# Altium project flight controller 2.PrjPcb
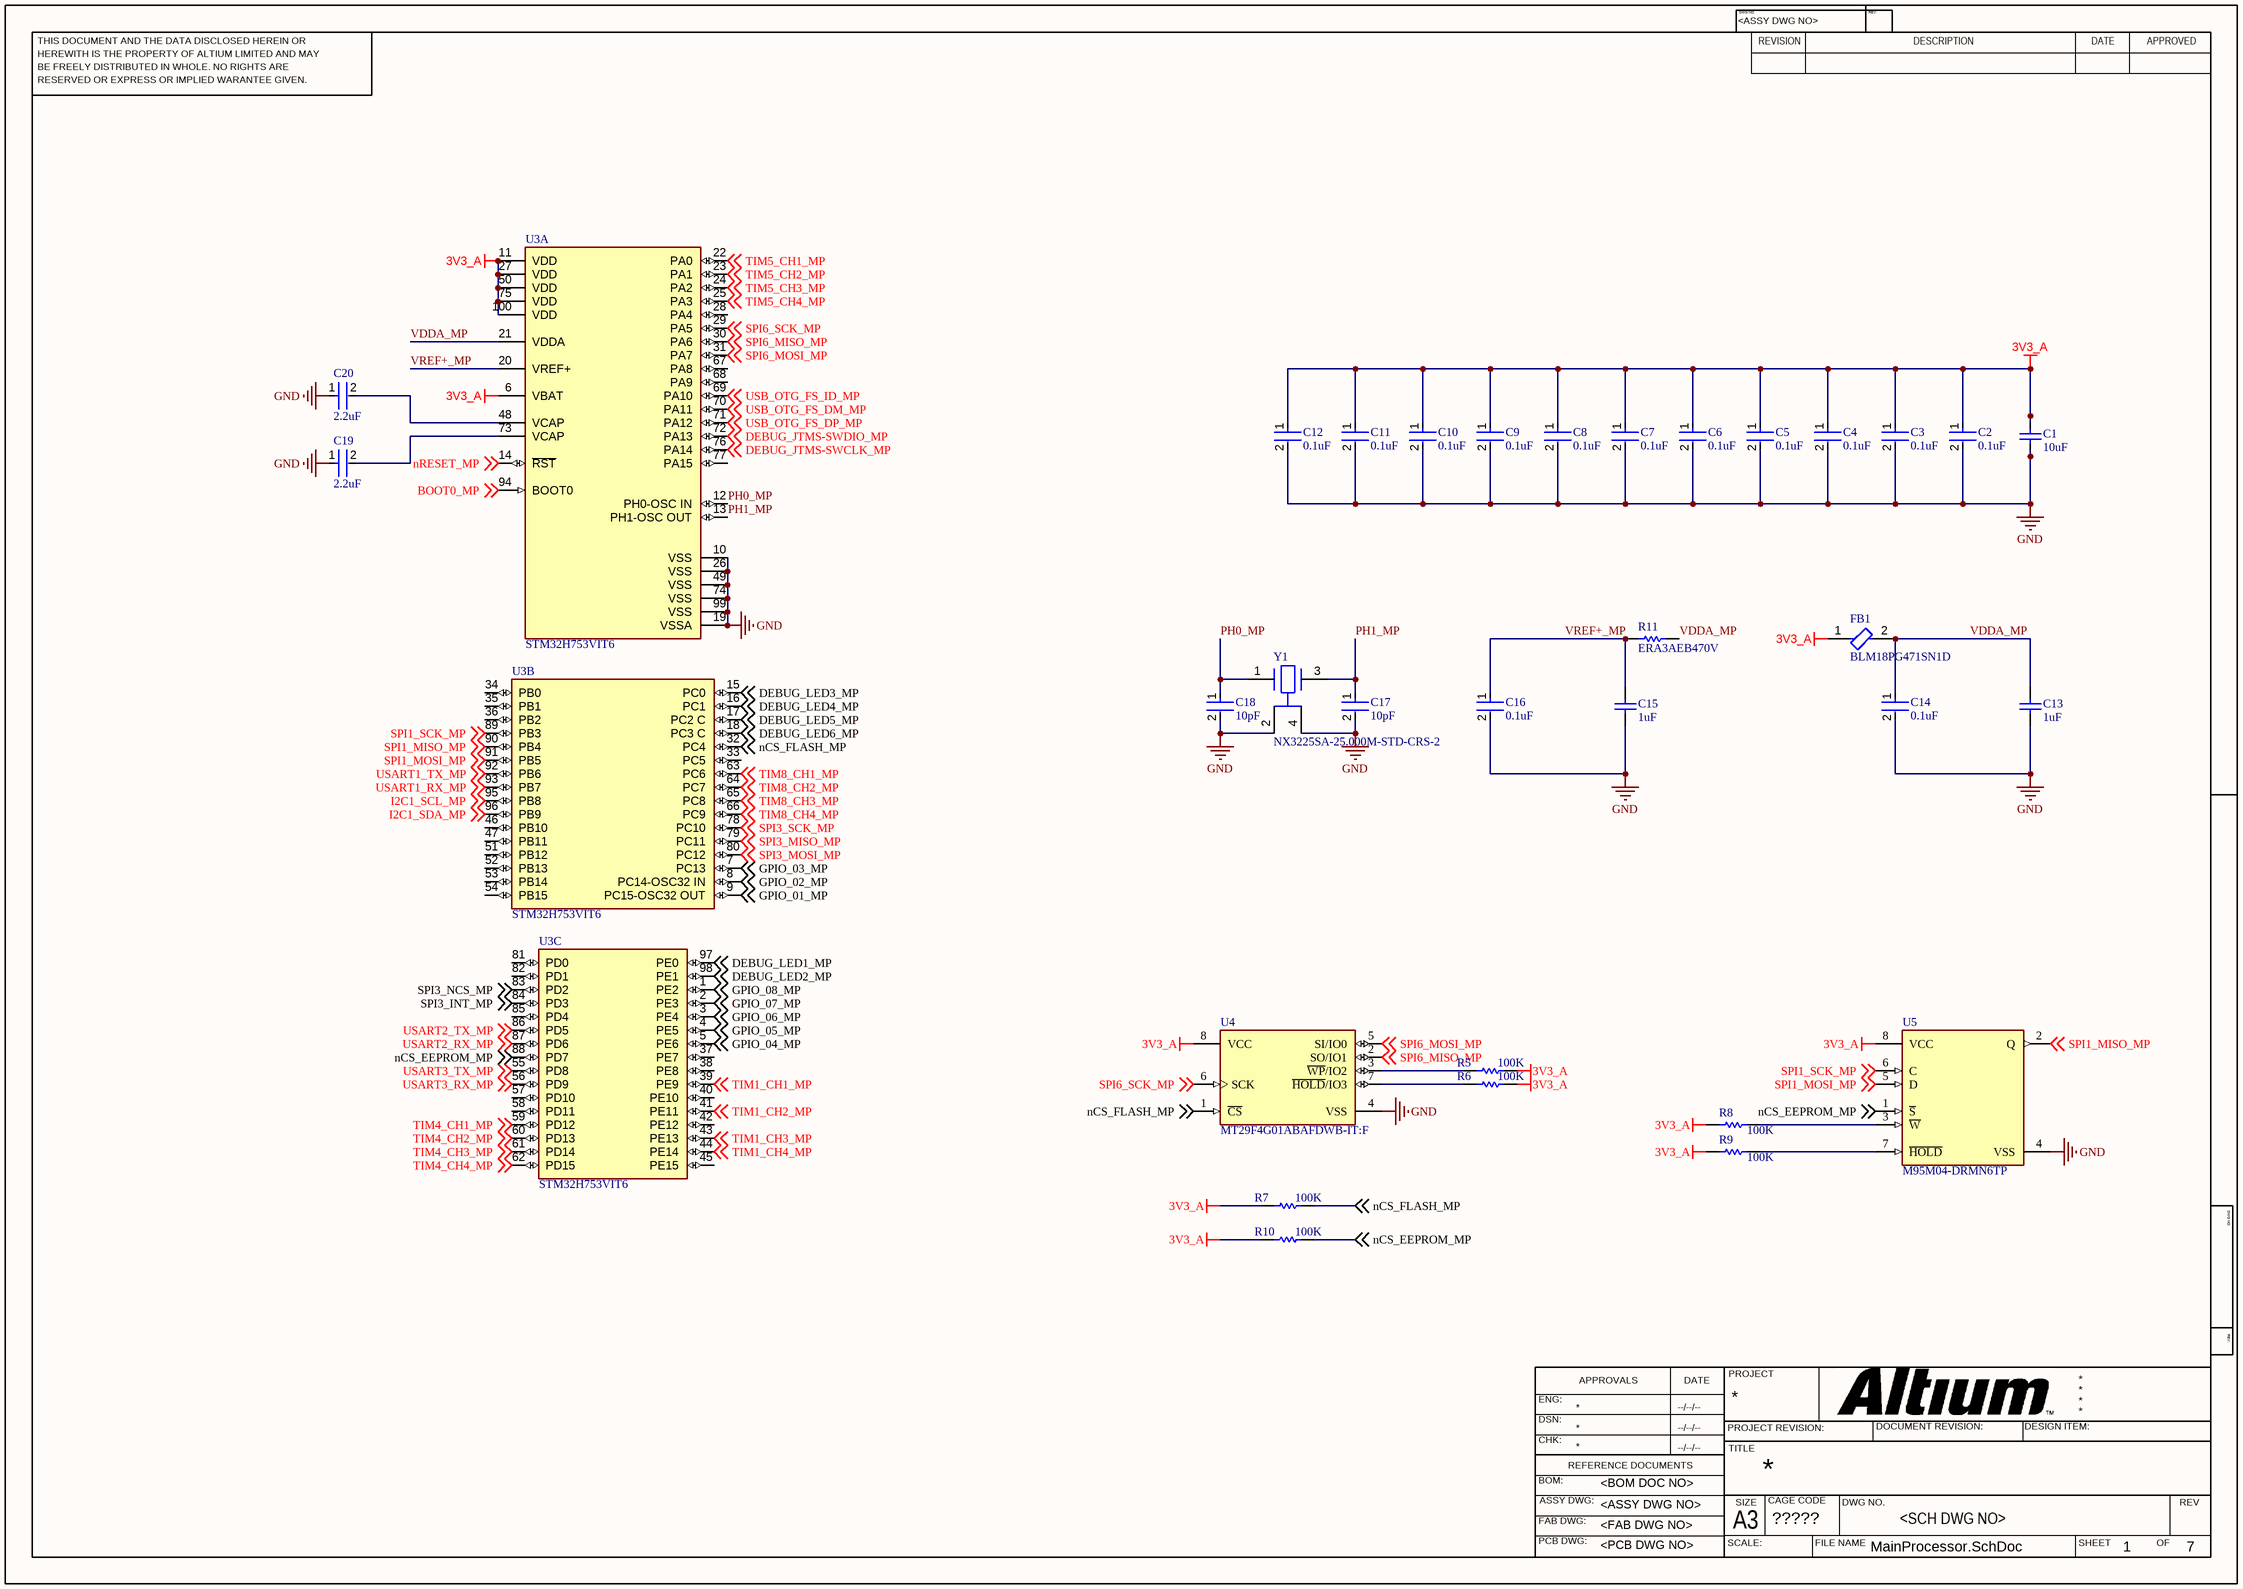
[diagram p0: MainProcessor.SchDoc]
CAGE_CODE: ?????; CONTRACT_NUMBER: <CONTRACT NO>; DOC_NO_ASSY_DWG: <ASSY DWG NO>; DOC_NO_BOM: <BOM DOC NO>; DOC_NO_FAB_DWG: <FAB DWG NO>; DOC_NO_SCH_DWG: <SCH DWG NO>; PCB_2_DEC_TOL: +/-.01; PCB_3_DEC_TOL: +/-.010; PCB_ANG_TOL: +/-1/2; PCB_ASSEMBLY_NO: <PCB ASSY NO>; PCB_CHECKER: - -----; PCB_CHECKER_APP_DATE: --/--/----; PCB_DESIGNER: - -----; PCB_DESIGNER_APP_DATE: --/--/----; PCB_DWG_NO: <PCB DWG NO>; PCB_ENGINEER: - -----; PCB_ENGINEER_APP_DATE: --/--/----; PCB_PART_NUMBER: <PCB PN>; PCB_REV: A; SCH_REV: A
4 sheets, 123 parts. Net scope: global (net labels, ports and power ports of the same name join across sheets).
Board file: flight controller rev2.PcbDoc
Sheets:
  MainProcessor.SchDoc
  CoProcessor.SchDoc
  Debug.SchDoc
  Baro_Mag.SchDoc

## Sheet MainProcessor.SchDoc
size 420 x 297 mm; SheetNumber: 1; SheetTotal: 7; ENG_APP_DATE: --/--/--; DSN_APP_DATE: --/--/--; CHK_APP_DATE: --/--/--

### Parts
C1  10uF  [CAPC2013X145X50LL20T25]
C2  0.1uF  [FP-C0603C-CF-MFG]
C3  0.1uF  [FP-C0603C-CF-MFG]
C4  0.1uF  [FP-C0603C-CF-MFG]
C5  0.1uF  [FP-C0603C-CF-MFG]
C6  0.1uF  [FP-C0603C-CF-MFG]
C7  0.1uF  [FP-C0603C-CF-MFG]
C8  0.1uF  [FP-C0603C-CF-MFG]
C9  0.1uF  [FP-C0603C-CF-MFG]
C10  0.1uF  [FP-C0603C-CF-MFG]
C11  0.1uF  [FP-C0603C-CF-MFG]
C12  0.1uF  [FP-C0603C-CF-MFG]
C13  1uF  [CAPC1608X90X35LL15T15]
C14  0.1uF  [FP-C0603C-CF-MFG]
C15  1uF  [CAPC1608X90X35LL15T15]
C16  0.1uF  [FP-C0603C-CF-MFG]
C17  10pF  [FP-C0603C-CF-MFG]
C18  10pF  [FP-C0603C-CF-MFG]
C19  2.2uF  [FP-GRM188-0_1-e0_2_0_5-MFG]
C20  2.2uF  [FP-GRM188-0_1-e0_2_0_5-MFG]
FB1  BLM18PG471SN1D  [FP-BLM18-0_15-t0_8-MFG]
R5  100K  [RESC1608X55X30ML20T10]
R6  100K  [RESC1608X55X30ML20T10]
R7  100K  [RESC1608X55X30ML20T10]
R8  100K  [RESC1608X55X30ML20T10]
R9  100K  [RESC1608X55X30ML20T10]
R10  100K  [RESC1608X55X30ML20T10]
R11  ERA3AEB470V  [RESC1608X55X30NL20T20]
U3  STM32H753VIT6  [FP-LQFP100-1L-MFG]  (parts A,B,C of 3)
U4  MT29F4G01ABAFDWB-IT:F  [FP-WB-IPC_B]
U5  M95M04-DRMN6TP  [FP-SO8N-SO-A-IPC_C]
Y1  NX3225SA-25.000M-STD-CRS-2  [FP-NX3225SA-MFG]

### Nets
3V3_A: C1.1 C2.1 C3.1 C4.1 C5.1 C6.1 C7.1 C8.1 C9.1 C10.1 C11.1 C12.1 FB1.1 R5.2 R6.2 R7.2 R8.2 R9.2 R10.2 U3.6(VBAT) U3.11(VDD) U3.27(VDD) U3.50(VDD) U3.75(VDD) U3.100(VDD) U4.8(VCC) U5.8(VCC)
GND: C1.2 C2.2 C3.2 C4.2 C5.2 C6.2 C7.2 C8.2 C9.2 C10.2 C11.2 C12.2 C13.2 C14.2 C15.2 C16.2 C17.2 C18.2 C19.1 C20.1 U3.10(VSS) U3.19(VSSA) U3.26(VSS) U3.49(VSS) U3.74(VSS) U3.99(VSS) U4.4(VSS) U5.4(VSS) Y1.2(GND) Y1.4(GND)
BOOT0_MP: U3.94(BOOT0) ; off-sheet BOOT0_MP
DEBUG_JTMS-SWCLK_MP: U3.76(PA14) ; off-sheet DEBUG_JTMS-SWCLK_MP
DEBUG_JTMS-SWDIO_MP: U3.72(PA13) ; off-sheet DEBUG_JTMS-SWDIO_MP
DEBUG_LED1_MP: U3.97(PE0) ; off-sheet DEBUG_LED1_MP
DEBUG_LED2_MP: U3.98(PE1) ; off-sheet DEBUG_LED2_MP
DEBUG_LED3_MP: U3.15(PC0) ; off-sheet DEBUG_LED3_MP
DEBUG_LED4_MP: U3.16(PC1) ; off-sheet DEBUG_LED4_MP
DEBUG_LED5_MP: U3.17(PC2_C) ; off-sheet DEBUG_LED5_MP
DEBUG_LED6_MP: U3.18(PC3_C) ; off-sheet DEBUG_LED6_MP
GPIO_01_MP: U3.9(PC15-OSC32_OUT) ; off-sheet GPIO_01_MP
GPIO_02_MP: U3.8(PC14-OSC32_IN) ; off-sheet GPIO_02_MP
GPIO_03_MP: U3.7(PC13) ; off-sheet GPIO_03_MP
GPIO_04_MP: U3.5(PE6) ; off-sheet GPIO_04_MP
GPIO_05_MP: U3.4(PE5) ; off-sheet GPIO_05_MP
GPIO_06_MP: U3.3(PE4) ; off-sheet GPIO_06_MP
GPIO_07_MP: U3.2(PE3) ; off-sheet GPIO_07_MP
GPIO_08_MP: U3.1(PE2) ; off-sheet GPIO_08_MP
I2C1_SCL_MP: U3.95(PB8) ; off-sheet I2C1_SCL_MP
I2C1_SDA_MP: U3.96(PB9) ; off-sheet I2C1_SDA_MP
nCS_EEPROM_MP: R10.1 U3.88(PD7) U5.1(~{S}) ; off-sheet nCS_EEPROM_MP
nCS_FLASH_MP: R7.1 U3.32(PC4) U4.1(~{CS}) ; off-sheet nCS_FLASH_MP
nRESET_MP: U3.14(~{RST}) ; off-sheet nRESET_MP
PH0_MP: C18.1 U3.12(PH0-OSC_IN) Y1.1
PH1_MP: C17.1 U3.13(PH1-OSC_OUT) Y1.3
SPI1_MISO_MP: U3.90(PB4) U5.2(Q) ; off-sheet SPI1_MISO_MP
SPI1_MOSI_MP: U3.91(PB5) U5.5(D) ; off-sheet SPI1_MOSI_MP
SPI1_SCK_MP: U3.89(PB3) U5.6(C) ; off-sheet SPI1_SCK_MP
SPI3_INT_MP: U3.84(PD3) ; off-sheet SPI3_INT_MP
SPI3_MISO_MP: U3.79(PC11) ; off-sheet SPI3_MISO_MP
SPI3_MOSI_MP: U3.80(PC12) ; off-sheet SPI3_MOSI_MP
SPI3_NCS_MP: U3.83(PD2) ; off-sheet SPI3_NCS_MP
SPI3_SCK_MP: U3.78(PC10) ; off-sheet SPI3_SCK_MP
SPI6_MISO_MP: U3.30(PA6) U4.2(SO/IO1) ; off-sheet SPI6_MISO_MP
SPI6_MOSI_MP: U3.31(PA7) U4.5(SI/IO0) ; off-sheet SPI6_MOSI_MP
SPI6_SCK_MP: U3.29(PA5) U4.6(SCK) ; off-sheet SPI6_SCK_MP
TIM1_CH1_MP: U3.39(PE9) ; off-sheet TIM1_CH1_MP
TIM1_CH2_MP: U3.41(PE11) ; off-sheet TIM1_CH2_MP
TIM1_CH3_MP: U3.43(PE13) ; off-sheet TIM1_CH3_MP
TIM1_CH4_MP: U3.44(PE14) ; off-sheet TIM1_CH4_MP
TIM4_CH1_MP: U3.59(PD12) ; off-sheet TIM4_CH1_MP
TIM4_CH2_MP: U3.60(PD13) ; off-sheet TIM4_CH2_MP
TIM4_CH3_MP: U3.61(PD14) ; off-sheet TIM4_CH3_MP
TIM4_CH4_MP: U3.62(PD15) ; off-sheet TIM4_CH4_MP
TIM5_CH1_MP: U3.22(PA0) ; off-sheet TIM5_CH1_MP
TIM5_CH2_MP: U3.23(PA1) ; off-sheet TIM5_CH2_MP
TIM5_CH3_MP: U3.24(PA2) ; off-sheet TIM5_CH3_MP
TIM5_CH4_MP: U3.25(PA3) ; off-sheet TIM5_CH4_MP
TIM8_CH1_MP: U3.63(PC6) ; off-sheet TIM8_CH1_MP
TIM8_CH2_MP: U3.64(PC7) ; off-sheet TIM8_CH2_MP
TIM8_CH3_MP: U3.65(PC8) ; off-sheet TIM8_CH3_MP
TIM8_CH4_MP: U3.66(PC9) ; off-sheet TIM8_CH4_MP
USART1_RX_MP: U3.93(PB7) ; off-sheet USART1_RX_MP
USART1_TX_MP: U3.92(PB6) ; off-sheet USART1_TX_MP
USART2_RX_MP: U3.87(PD6) ; off-sheet USART2_RX_MP
USART2_TX_MP: U3.86(PD5) ; off-sheet USART2_TX_MP
USART3_RX_MP: U3.56(PD9) ; off-sheet USART3_RX_MP
USART3_TX_MP: U3.55(PD8) ; off-sheet USART3_TX_MP
USB_OTG_FS_DM_MP: U3.70(PA11) ; off-sheet USB_OTG_FS_DM_MP
USB_OTG_FS_DP_MP: U3.71(PA12) ; off-sheet USB_OTG_FS_DP_MP
USB_OTG_FS_ID_MP: U3.69(PA10) ; off-sheet USB_OTG_FS_ID_MP
VDDA_MP: C13.1 C14.1 FB1.2 R11.2 U3.21(VDDA)
VREF+_MP: C15.1 C16.1 R11.1 U3.20(VREF+)
NetC19_2: C19.2 U3.73(VCAP)
NetC20_2: C20.2 U3.48(VCAP)
NetR5_1: R5.1 U4.3(~{WP}/IO2)
NetR6_1: R6.1 U4.7(~{HOLD}/IO3)
NetR8_1: R8.1 U5.3(~{W})
NetR9_1: R9.1 U5.7(~{HOLD})

Not connected (* = marked no-connect by the designer): U3 28(PA4) 33(PC5) 34(PB0) 35(PB1) 36(PB2) 37(PE7) 38(PE8) 40(PE10) 42(PE12) 45(PE15) 46(PB10) 47(PB11) 51(PB12) 52(PB13) 53(PB14) 54(PB15) 57(PD10) 58(PD11) 67(PA8) 68(PA9) 77(PA15) 81(PD0) 82(PD1) 85(PD4)

### Notes on the sheet
- THIS DOCUMENT AND THE DATA DISCLOSED HEREIN OR
- HEREWITH IS THE PROPERTY OF ALTIUM LIMITED AND MAY
- DWG NO:
- REVISION
- REV:
- DESCRIPTION
- DATE
- APPROVED
- BE FREELY DISTRIBUTED IN WHOLE. NO RIGHTS ARE
- RESERVED OR EXPRESS OR IMPLIED WARANTEE GIVEN.
- ENG:
- APPROVALS
- PROJECT
- DSN:
- CHK:
- REFERENCE DOCUMENTS
- PROJECT REVISION:
- TITLE
- DOCUMENT REVISION:
- DESIGN ITEM:
- BOM:
- FAB DWG:
- PCB DWG:
- ASSY DWG:
- SCALE:
- A3
- SIZE
- CAGE CODE
- FILE NAME
- DWG NO.
- SHEET
- OF
- REV

### Library data of the parts
C1 = CMP-2007-01044-1: Manufacturer: Kemet; Part Number: C0805C106K8RACTU
C2-C12 C14 C16 = CMP-2006-03061-2: CAP CER 0.1UF 50V X7R 0603; Manufacturer: KEMET; Manufacturer Part Number: C0603C104K5RACTU; Tolerance: 0.1; Temperature Coefficient: 30ppm/°C; Material: Ceramic; Automotive Grade: Grade 1; Value: 0.10 μF; Temperature: -55°C to +125°C; RoHS: TRUE; Temperature Range High: +125°C; Lead Free: Yes; Octopart: https://octopart.com/c0603c104k5ractu-kemet-139244; Digikey Description: CAP CER 0.1UF 50V X7R 0603; Category: Cap; Package: C0603C-CF; ComponentLink2Description: Datasheet; Temperature Range Low: -55°C; Device Class L1: Passive Components; Voltage Rating: 50 V; Automotive: Yes; Device Class L3: Ceramic Capacitors; ComponentLink2URL: https://api.kemet.com/component-edge/download/datasheet/C0603C100J5GACAUTO.pdf; Capacitance: 0.10 μF; Device Class L2: Capacitors; Temperature Characteristic: X7R; Height: 0.87mm
C13 C15 = CMP-2006-02298-2: Manufacturer: Kemet; Part Number: C0603C105K4RACTU
C17 C18 = CMP-2006-03343-2: CAP CER 10PF 50V NP0 0603; Manufacturer: KEMET; Manufacturer Part Number: C0603C100C5GACTU; Material: Ceramic; Temperature Coefficient: 30ppm/°C; Automotive Grade: Grade 1; Tolerance: 0.25 pF; Temperature Characteristic: C0G; Device Class L3: Ceramic Capacitors; Value: 10 pF; Device Class L1: Passive Components; Lead Free: Yes; RoHS: TRUE; Voltage Rating: 50 V; Automotive: Yes; Capacitance: 10 pF; Height: 0.87mm; Temperature Range Low: -55°C; Temperature Range High: +125°C; Mouser Description: Multilayer Ceramic Capacitors MLCC - SMD/SMT 50volts 10pF C0G 0.25%; Device Class L2: Capacitors; Digikey Description: CAP CER 10PF 50V NP0 0603; ComponentLink2Description: Datasheet; Package: C0603C-CF; ComponentLink2URL: https://api.kemet.com/component-edge/download/datasheet/C0603C100J5GACAUTO.pdf; Category: Cap; Octopart: https://octopart.com/c0603c100c5gactu-kemet-9138556; Temperature: -55°C to +125°C
C19 C20 = CMP-2006-02836-2: Chip Multilayer Ceramic Capacitors for General Purpose, 0603, 2.2uF, X7R, 15%, 10%, 10V; Case Code (Metric): 1608; Height: 0.8mm; Packaging: Cut Tape; Voltage: 10V; Lead Free: Lead Free; Min Operating Temperature: -55°C; Voltage Rating (DC): 10V; Max Operating Temperature: 125°C; Voltage Rating: 10V; Dielectric: X7R; Depth: 0.8mm; Case Code (Imperial): 0603; Termination: SMD/SMT; Case/Package: 0603; Number of Pins: 2; REACH SVHC: No SVHC; Mount: Surface Mount; Width: 0.031inch; Material: Ceramic; Capacitance: 2.2uF; Package Quantity: 1; Weight: 7.1E-05oz; Length: 1.6mm; Thickness: 0.035inch; Tolerance: 10%
FB1 = CMP-0686-00587-3: Chip Ferrite Bead, 0603, 470Ω @ 100MHz, 0.2Ω, 25%, 1A; DC Resistance (DCR): 200mR; Number of Circuits: 1; Material: Steel; Impedance: 470R; Core Material: Ferrite; Width: 0.8mm; Termination: SMD/SMT; Series: BLM18P; Min Operating Temperature: -55°C; DC Resistance-Max: 200mR; Current Rating: 1A; Package Quantity: 1; Max Operating Temperature: 125°C; Military Standard: Not; REACH SVHC: No SVHC; Max Current Rating: 1A; Number of Pins: 2; RoHS Compliant: Yes; Tolerance: 25%; Packaging: Tape and Reel; Number of Lines: 1; Resistance: 200mR; Length: 1.6mm; Case Code (Metric): 1608; Depth: 0.8mm; Lead Free: Lead Free; Case/Package: 0603; Height: 0.8mm; Radiation Hardening: No; Test Frequency: 100MHz; Case Code (Imperial): 0603; Max DC Current: 1A; DC Current: 1A
R5-R10 = CMP-2000-01852-1: Part Number: RK73B1JTTD104J; Manufacturer: KOA Speer
R11 = CMP-2000-00070-1: Manufacturer: Panasonic; Part Number: ERA3AEB470V
U3 = CMP-12105-000037-1: LQFP 100 14X14X1.4; Manufacturer: STMicroelectronics; Number Of Cores: 1; Interface: I2C,SPI,UART,USART,CAN,USB,Ethernet,I2S,Other; Standoff Height: 0.05mm; Number Of Pwm Channels: 2; Number Of Timers/Counters: 20; Number Of A/D Converters: 5; Number Of Uart Channels: 4; Memory Type: FLASH; Number Of Spi Channels: 6; Core Architecture: ARM Cortex-M7; Max Junction Temp: +125°C; Max Supply Voltage: 3.6V; Number Of Adc Channels: 36; Data Bus Width: 32bits; Number Of I/Os: 82; Ram Size: 1MBytes; Frequency: 480MHz; Memory Size: 2MBytes; Min Supply Voltage: 1.71V; Lead Free: Yes; Octopart: https://octopart.com/stm32h753vit6-stmicroelectronics-87879769; Category: IC; Digikey Description: LQFP 100 14X14X1.4; ComponentLink2Description: Datasheet; RoHS: TRUE; Device Class L1: Integrated Circuits (ICs); Mouser Description: MCU 32-Bit STM32 ARM Cortex M7 RISC 2MB Flash 1.8V/2.5V/3.3V 100-Pin LQFP Tray; ComponentLink2URL: https://www.st.com/resource/en/datasheet/stm32h753vi.pdf; Ambient Temperature Range Low: -40°C; Device Class L3: Microcontrollers; Ambient Temperature Range High: +85°C; Temperature Range Low: -40°C; Height: 1.6mm; Temperature Range High: +85°C; Automotive: No; Number Of I2C Channels: 4; Temperature: -40°C to +85°C; Ipc Land Pattern Name: QFP50P1600X1600X160-100; Manufacturer Part Number: STM32H753VIT6; Device Class L2: Embedded Processors and Controllers; Package: LQFP100-1L
U4 = CMP-14958-000017-1: IC FLASH 4GBIT SPI UPDFN; Memory Type: Non-Volatile; Memory Size: 4Gb; Min Operating Temperature: -40°C; Packaging: Box; Series: -; Max Operating Temperature: 85°C
U5 = CMP-12142-000020-1: STANDARD SERIAL EEPROM; RoHS Compliant: Yes
Y1 = CMP-200220-000002-1: CRYSTAL 25.0000MHZ 8PF SMD; Manufacturer: NDK; Frequency: 25MHz; Automotive Grade: Grade 1; Esr: 100Ω; Tolerance: 15ppm; Digikey Description: CRYSTAL 25.0000MHZ 8PF SMD; Temperature Range Low: -40°C; Octopart: https://octopart.com/nx3225sa-25.000m-std-crs-2-ndk-51374293; Series: NX3225SA; Manufacturer Part Number: NX3225SA-25.000M-STD-CRS-2; ComponentLink2URL: https://www.ndk.com/images/products/catalog/c_NX3225SA-STD-CRS-2_e.pdf; Lead Free: Yes; Device Class L2: Crystals / Oscillators; ComponentLink2Description: Datasheet; Device Class L3: Crystals; Category: Crys; Device Class L1: Passive Components; Automotive: Yes; RoHS: TRUE; Load Capacitance: 8pF; Height: 0.6mm; Temperature Range High: +125°C; Package: NX3225SA; Temperature: -40°C to +125°C

## Sheet CoProcessor.SchDoc
size 420 x 297 mm; SheetNumber: 2; SheetTotal: 7
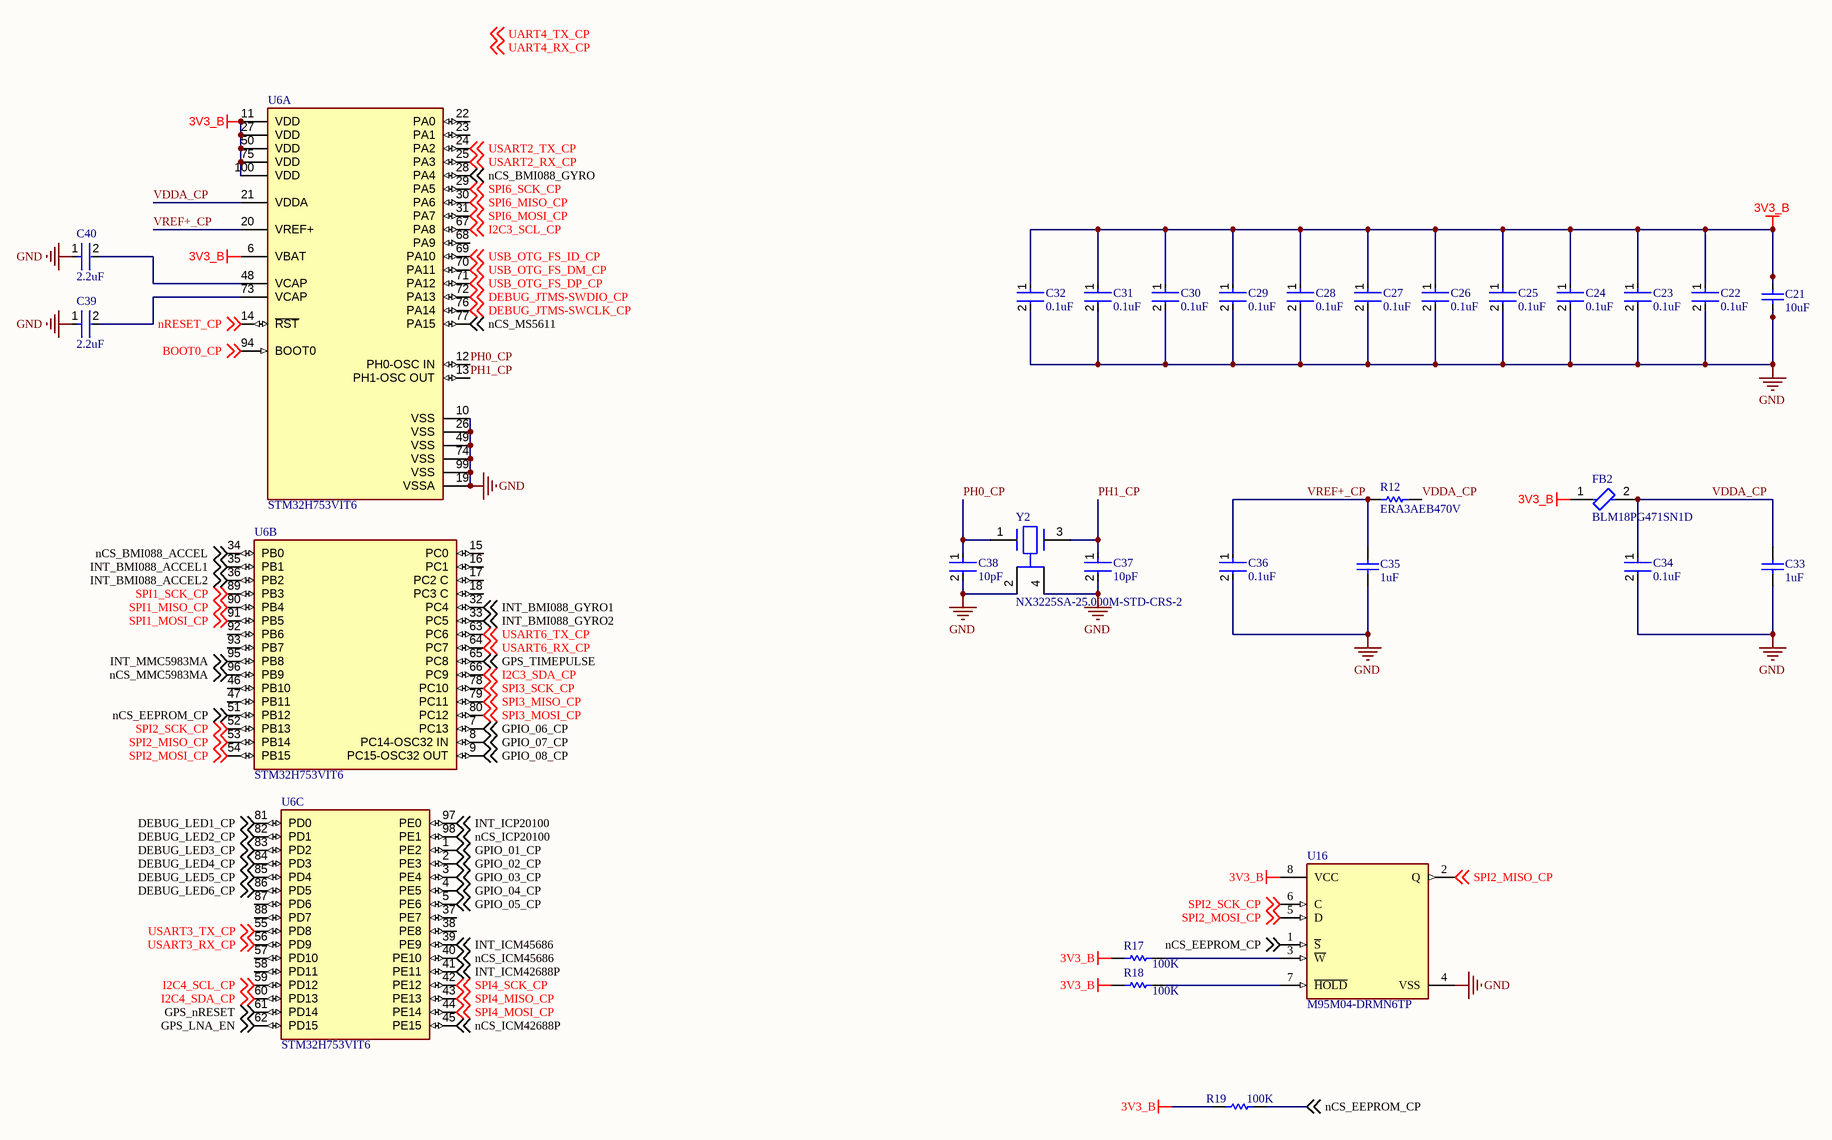
[diagram p1: CoProcessor.SchDoc]

### Parts
C21  10uF  [CAPC2013X145X50LL20T25]
C22  0.1uF  [FP-C0603C-CF-MFG]
C23  0.1uF  [FP-C0603C-CF-MFG]
C24  0.1uF  [FP-C0603C-CF-MFG]
C25  0.1uF  [FP-C0603C-CF-MFG]
C26  0.1uF  [FP-C0603C-CF-MFG]
C27  0.1uF  [FP-C0603C-CF-MFG]
C28  0.1uF  [FP-C0603C-CF-MFG]
C29  0.1uF  [FP-C0603C-CF-MFG]
C30  0.1uF  [FP-C0603C-CF-MFG]
C31  0.1uF  [FP-C0603C-CF-MFG]
C32  0.1uF  [FP-C0603C-CF-MFG]
C33  1uF  [CAPC1608X90X35LL15T15]
C34  0.1uF  [FP-C0603C-CF-MFG]
C35  1uF  [CAPC1608X90X35LL15T15]
C36  0.1uF  [FP-C0603C-CF-MFG]
C37  10pF  [FP-C0603C-CF-MFG]
C38  10pF  [FP-C0603C-CF-MFG]
C39  2.2uF  [FP-GRM188-0_1-e0_2_0_5-MFG]
C40  2.2uF  [FP-GRM188-0_1-e0_2_0_5-MFG]
FB2  BLM18PG471SN1D  [FP-BLM18-0_15-t0_8-MFG]
R12  ERA3AEB470V  [RESC1608X55X30NL20T20]
R17  100K  [RESC1608X55X30ML20T10]
R18  100K  [RESC1608X55X30ML20T10]
R19  100K  [RESC1608X55X30ML20T10]
U6  STM32H753VIT6  [FP-LQFP100-1L-MFG]  (parts A,B,C of 3)
U16  M95M04-DRMN6TP  [FP-SO8N-SO-A-IPC_C]
Y2  NX3225SA-25.000M-STD-CRS-2  [FP-NX3225SA-MFG]

### Nets
3V3_B: C21.1 C22.1 C23.1 C24.1 C25.1 C26.1 C27.1 C28.1 C29.1 C30.1 C31.1 C32.1 FB2.1 R17.2 R18.2 R19.2 U6.6(VBAT) U6.11(VDD) U6.27(VDD) U6.50(VDD) U6.75(VDD) U6.100(VDD) U16.8(VCC)
GND: C21.2 C22.2 C23.2 C24.2 C25.2 C26.2 C27.2 C28.2 C29.2 C30.2 C31.2 C32.2 C33.2 C34.2 C35.2 C36.2 C37.2 C38.2 C39.1 C40.1 U6.10(VSS) U6.19(VSSA) U6.26(VSS) U6.49(VSS) U6.74(VSS) U6.99(VSS) U16.4(VSS) Y2.2(GND) Y2.4(GND)
BOOT0_CP: U6.94(BOOT0) ; off-sheet BOOT0_CP
DEBUG_JTMS-SWCLK_CP: U6.76(PA14) ; off-sheet DEBUG_JTMS-SWCLK_CP
DEBUG_JTMS-SWDIO_CP: U6.72(PA13) ; off-sheet DEBUG_JTMS-SWDIO_CP
DEBUG_LED1_CP: U6.81(PD0) ; off-sheet DEBUG_LED1_CP
DEBUG_LED2_CP: U6.82(PD1) ; off-sheet DEBUG_LED2_CP
DEBUG_LED3_CP: U6.83(PD2) ; off-sheet DEBUG_LED3_CP
DEBUG_LED4_CP: U6.84(PD3) ; off-sheet DEBUG_LED4_CP
DEBUG_LED5_CP: U6.85(PD4) ; off-sheet DEBUG_LED5_CP
DEBUG_LED6_CP: U6.86(PD5) ; off-sheet DEBUG_LED6_CP
GPIO_01_CP: U6.1(PE2) ; off-sheet GPIO_01_CP
GPIO_02_CP: U6.2(PE3) ; off-sheet GPIO_02_CP
GPIO_03_CP: U6.3(PE4) ; off-sheet GPIO_03_CP
GPIO_04_CP: U6.4(PE5) ; off-sheet GPIO_04_CP
GPIO_05_CP: U6.5(PE6) ; off-sheet GPIO_05_CP
GPIO_06_CP: U6.7(PC13) ; off-sheet GPIO_06_CP
GPIO_07_CP: U6.8(PC14-OSC32_IN) ; off-sheet GPIO_07_CP
GPIO_08_CP: U6.9(PC15-OSC32_OUT) ; off-sheet GPIO_08_CP
GPS_LNA_EN: U6.62(PD15) ; off-sheet GPS_LNA_EN
GPS_nRESET: U6.61(PD14) ; off-sheet GPS_nRESET
GPS_TIMEPULSE: U6.65(PC8) ; off-sheet GPS_TIMEPULSE
I2C3_SCL_CP: U6.67(PA8) ; off-sheet I2C3_SCL_CP
I2C3_SDA_CP: U6.66(PC9) ; off-sheet I2C3_SDA_CP
I2C4_SCL_CP: U6.59(PD12) ; off-sheet I2C4_SCL_CP
I2C4_SDA_CP: U6.60(PD13) ; off-sheet I2C4_SDA_CP
INT_BMI088_ACCEL1: U6.35(PB1) ; off-sheet INT_BMI088_ACCEL1
INT_BMI088_ACCEL2: U6.36(PB2) ; off-sheet INT_BMI088_ACCEL2
INT_BMI088_GYRO1: U6.32(PC4) ; off-sheet INT_BMI088_GYRO1
INT_BMI088_GYRO2: U6.33(PC5) ; off-sheet INT_BMI088_GYRO2
INT_ICM42688P: U6.41(PE11) ; off-sheet INT_ICM42688P
INT_ICM45686: U6.39(PE9) ; off-sheet INT_ICM45686
INT_ICP20100: U6.97(PE0) ; off-sheet INT_ICP20100
INT_MMC5983MA: U6.95(PB8) ; off-sheet INT_MMC5983MA
nCS_BMI088_ACCEL: U6.34(PB0) ; off-sheet nCS_BMI088_ACCEL
nCS_BMI088_GYRO: U6.28(PA4) ; off-sheet nCS_BMI088_GYRO
nCS_EEPROM_CP: R19.1 U6.51(PB12) U16.1(~{S}) ; off-sheet nCS_EEPROM_CP
nCS_ICM42688P: U6.45(PE15) ; off-sheet nCS_ICM42688P
nCS_ICM45686: U6.40(PE10) ; off-sheet nCS_ICM45686
nCS_ICP20100: U6.98(PE1) ; off-sheet nCS_ICP20100
nCS_MMC5983MA: U6.96(PB9) ; off-sheet nCS_MMC5983MA
nCS_MS5611: U6.77(PA15) ; off-sheet nCS_MS5611
nRESET_CP: U6.14(~{RST}) ; off-sheet nRESET_CP
PH0_CP: C38.1 U6.12(PH0-OSC_IN) Y2.1
PH1_CP: C37.1 U6.13(PH1-OSC_OUT) Y2.3
SPI1_MISO_CP: U6.90(PB4) ; off-sheet SPI1_MISO_CP
SPI1_MOSI_CP: U6.91(PB5) ; off-sheet SPI1_MOSI_CP
SPI1_SCK_CP: U6.89(PB3) ; off-sheet SPI1_SCK_CP
SPI2_MISO_CP: U6.53(PB14) U16.2(Q) ; off-sheet SPI2_MISO_CP
SPI2_MOSI_CP: U6.54(PB15) U16.5(D) ; off-sheet SPI2_MOSI_CP
SPI2_SCK_CP: U6.52(PB13) U16.6(C) ; off-sheet SPI2_SCK_CP
SPI3_MISO_CP: U6.79(PC11) ; off-sheet SPI3_MISO_CP
SPI3_MOSI_CP: U6.80(PC12) ; off-sheet SPI3_MOSI_CP
SPI3_SCK_CP: U6.78(PC10) ; off-sheet SPI3_SCK_CP
SPI4_MISO_CP: U6.43(PE13) ; off-sheet SPI4_MISO_CP
SPI4_MOSI_CP: U6.44(PE14) ; off-sheet SPI4_MOSI_CP
SPI4_SCK_CP: U6.42(PE12) ; off-sheet SPI4_SCK_CP
SPI6_MISO_CP: U6.30(PA6) ; off-sheet SPI6_MISO_CP
SPI6_MOSI_CP: U6.31(PA7) ; off-sheet SPI6_MOSI_CP
SPI6_SCK_CP: U6.29(PA5) ; off-sheet SPI6_SCK_CP
USART2_RX_CP: U6.25(PA3) ; off-sheet USART2_RX_CP
USART2_TX_CP: U6.24(PA2) ; off-sheet USART2_TX_CP
USART3_RX_CP: U6.56(PD9) ; off-sheet USART3_RX_CP
USART3_TX_CP: U6.55(PD8) ; off-sheet USART3_TX_CP
USART6_RX_CP: U6.64(PC7) ; off-sheet USART6_RX_CP
USART6_TX_CP: U6.63(PC6) ; off-sheet USART6_TX_CP
USB_OTG_FS_DM_CP: U6.70(PA11) ; off-sheet USB_OTG_FS_DM_CP
USB_OTG_FS_DP_CP: U6.71(PA12) ; off-sheet USB_OTG_FS_DP_CP
USB_OTG_FS_ID_CP: U6.69(PA10) ; off-sheet USB_OTG_FS_ID_CP
VDDA_CP: C33.1 C34.1 FB2.2 R12.2 U6.21(VDDA)
VREF+_CP: C35.1 C36.1 R12.1 U6.20(VREF+)
NetC39_2: C39.2 U6.73(VCAP)
NetC40_2: C40.2 U6.48(VCAP)
NetR17_1: R17.1 U16.3(~{W})
NetR18_1: R18.1 U16.7(~{HOLD})

Not connected (* = marked no-connect by the designer): U6 15(PC0) 16(PC1) 17(PC2_C) 18(PC3_C) 22(PA0) 23(PA1) 37(PE7) 38(PE8) 46(PB10) 47(PB11) 57(PD10) 58(PD11) 68(PA9) 87(PD6) 88(PD7) 92(PB6) 93(PB7)

### Notes on the sheet
- Labels drawn without touching a wire or pin: UART4_RX_CP, UART4_TX_CP
- THIS DOCUMENT AND THE DATA DISCLOSED HEREIN OR
- HEREWITH IS THE PROPERTY OF ALTIUM LIMITED AND MAY
- DWG NO:
- REVISION
- REV:
- DESCRIPTION
- DATE
- APPROVED
- BE FREELY DISTRIBUTED IN WHOLE. NO RIGHTS ARE
- RESERVED OR EXPRESS OR IMPLIED WARANTEE GIVEN.
- ENG:
- APPROVALS
- PROJECT
- DSN:
- CHK:
- REFERENCE DOCUMENTS
- PROJECT REVISION:
- TITLE
- DOCUMENT REVISION:
- DESIGN ITEM:
- BOM:
- FAB DWG:
- PCB DWG:
- ASSY DWG:
- SCALE:
- A3
- SIZE
- CAGE CODE
- FILE NAME
- DWG NO.
- SHEET
- OF
- REV

### Library data of the parts
C21 = CMP-2007-01044-1: as C1 on sheet MainProcessor
C22-C32 C34 C36 = CMP-2006-03061-2: as C2 on sheet MainProcessor; Temperature: -55°C to +125°C; RoHS: TRUE; Temperature Range High: +125°C; Lead Free: Yes; Octopart: https://octopart.com/c0603c104k5ractu-kemet-139244; Digikey Description: CAP CER 0.1UF 50V X7R 0603; Category: Cap; Package: C0603C-CF; ComponentLink2Description: Datasheet; Temperature Range Low: -55°C; Device Class L1: Passive Components; Voltage Rating: 50 V; Automotive: Yes; Device Class L3: Ceramic Capacitors; ComponentLink2URL: https://api.kemet.com/component-edge/download/datasheet/C0603C100J5GACAUTO.pdf; Capacitance: 0.10 μF; Device Class L2: Capacitors; Temperature Characteristic: X7R; Height: 0.87mm
C33 C35 = CMP-2006-02298-2: as C13 on sheet MainProcessor
C37 C38 = CMP-2006-03343-2: as C17 on sheet MainProcessor; Device Class L3: Ceramic Capacitors; Value: 10 pF; Device Class L1: Passive Components; Lead Free: Yes; RoHS: TRUE; Voltage Rating: 50 V; Automotive: Yes; Capacitance: 10 pF; Height: 0.87mm; Temperature Range Low: -55°C; Temperature Range High: +125°C; Mouser Description: Multilayer Ceramic Capacitors MLCC - SMD/SMT 50volts 10pF C0G 0.25%; Device Class L2: Capacitors; Digikey Description: CAP CER 10PF 50V NP0 0603; ComponentLink2Description: Datasheet; Package: C0603C-CF; ComponentLink2URL: https://api.kemet.com/component-edge/download/datasheet/C0603C100J5GACAUTO.pdf; Category: Cap; Octopart: https://octopart.com/c0603c100c5gactu-kemet-9138556; Temperature: -55°C to +125°C
C39 C40 = CMP-2006-02836-2: as C19 on sheet MainProcessor; Case Code (Metric): 1608; Height: 0.8mm; Packaging: Cut Tape; Voltage: 10V; Lead Free: Lead Free; Min Operating Temperature: -55°C; Voltage Rating (DC): 10V; Max Operating Temperature: 125°C; Voltage Rating: 10V; Dielectric: X7R; Depth: 0.8mm; Case Code (Imperial): 0603; Termination: SMD/SMT; Case/Package: 0603; Number of Pins: 2; REACH SVHC: No SVHC; Mount: Surface Mount; Width: 0.031inch; Material: Ceramic; Capacitance: 2.2uF; Package Quantity: 1; Weight: 7.1E-05oz; Length: 1.6mm; Thickness: 0.035inch; Tolerance: 10%
FB2 = CMP-0686-00587-3: as FB1 on sheet MainProcessor; Core Material: Ferrite; Width: 0.8mm; Termination: SMD/SMT; Series: BLM18P; Min Operating Temperature: -55°C; DC Resistance-Max: 200mR; Current Rating: 1A; Package Quantity: 1; Max Operating Temperature: 125°C; Military Standard: Not; REACH SVHC: No SVHC; Max Current Rating: 1A; Number of Pins: 2; RoHS Compliant: Yes; Tolerance: 25%; Packaging: Tape and Reel; Number of Lines: 1; Resistance: 200mR; Length: 1.6mm; Case Code (Metric): 1608; Depth: 0.8mm; Lead Free: Lead Free; Case/Package: 0603; Height: 0.8mm; Radiation Hardening: No; Test Frequency: 100MHz; Case Code (Imperial): 0603; Max DC Current: 1A; DC Current: 1A
R12 = CMP-2000-00070-1: Manufacturer: Panasonic; Part Number: ERA3AEB470V
R17-R19 = CMP-2000-01852-1: as R5 on sheet MainProcessor
U6 = CMP-12105-000037-1: as U3 on sheet MainProcessor; Lead Free: Yes; Octopart: https://octopart.com/stm32h753vit6-stmicroelectronics-87879769; Category: IC; Digikey Description: LQFP 100 14X14X1.4; ComponentLink2Description: Datasheet; RoHS: TRUE; Device Class L1: Integrated Circuits (ICs); Mouser Description: MCU 32-Bit STM32 ARM Cortex M7 RISC 2MB Flash 1.8V/2.5V/3.3V 100-Pin LQFP Tray; ComponentLink2URL: https://www.st.com/resource/en/datasheet/stm32h753vi.pdf; Ambient Temperature Range Low: -40°C; Device Class L3: Microcontrollers; Ambient Temperature Range High: +85°C; Temperature Range Low: -40°C; Height: 1.6mm; Temperature Range High: +85°C; Automotive: No; Number Of I2C Channels: 4; Temperature: -40°C to +85°C; Ipc Land Pattern Name: QFP50P1600X1600X160-100; Manufacturer Part Number: STM32H753VIT6; Device Class L2: Embedded Processors and Controllers; Package: LQFP100-1L
U16 = CMP-12142-000020-1: STANDARD SERIAL EEPROM; RoHS Compliant: Yes
Y2 = CMP-200220-000002-1: as Y1 on sheet MainProcessor; Digikey Description: CRYSTAL 25.0000MHZ 8PF SMD; Temperature Range Low: -40°C; Octopart: https://octopart.com/nx3225sa-25.000m-std-crs-2-ndk-51374293; Series: NX3225SA; Manufacturer Part Number: NX3225SA-25.000M-STD-CRS-2; ComponentLink2URL: https://www.ndk.com/images/products/catalog/c_NX3225SA-STD-CRS-2_e.pdf; Lead Free: Yes; Device Class L2: Crystals / Oscillators; ComponentLink2Description: Datasheet; Device Class L3: Crystals; Category: Crys; Device Class L1: Passive Components; Automotive: Yes; RoHS: TRUE; Load Capacitance: 8pF; Height: 0.6mm; Temperature Range High: +125°C; Package: NX3225SA; Temperature: -40°C to +125°C

## Sheet Debug.SchDoc
size 420 x 297 mm; SheetNumber: 3; SheetTotal: 8
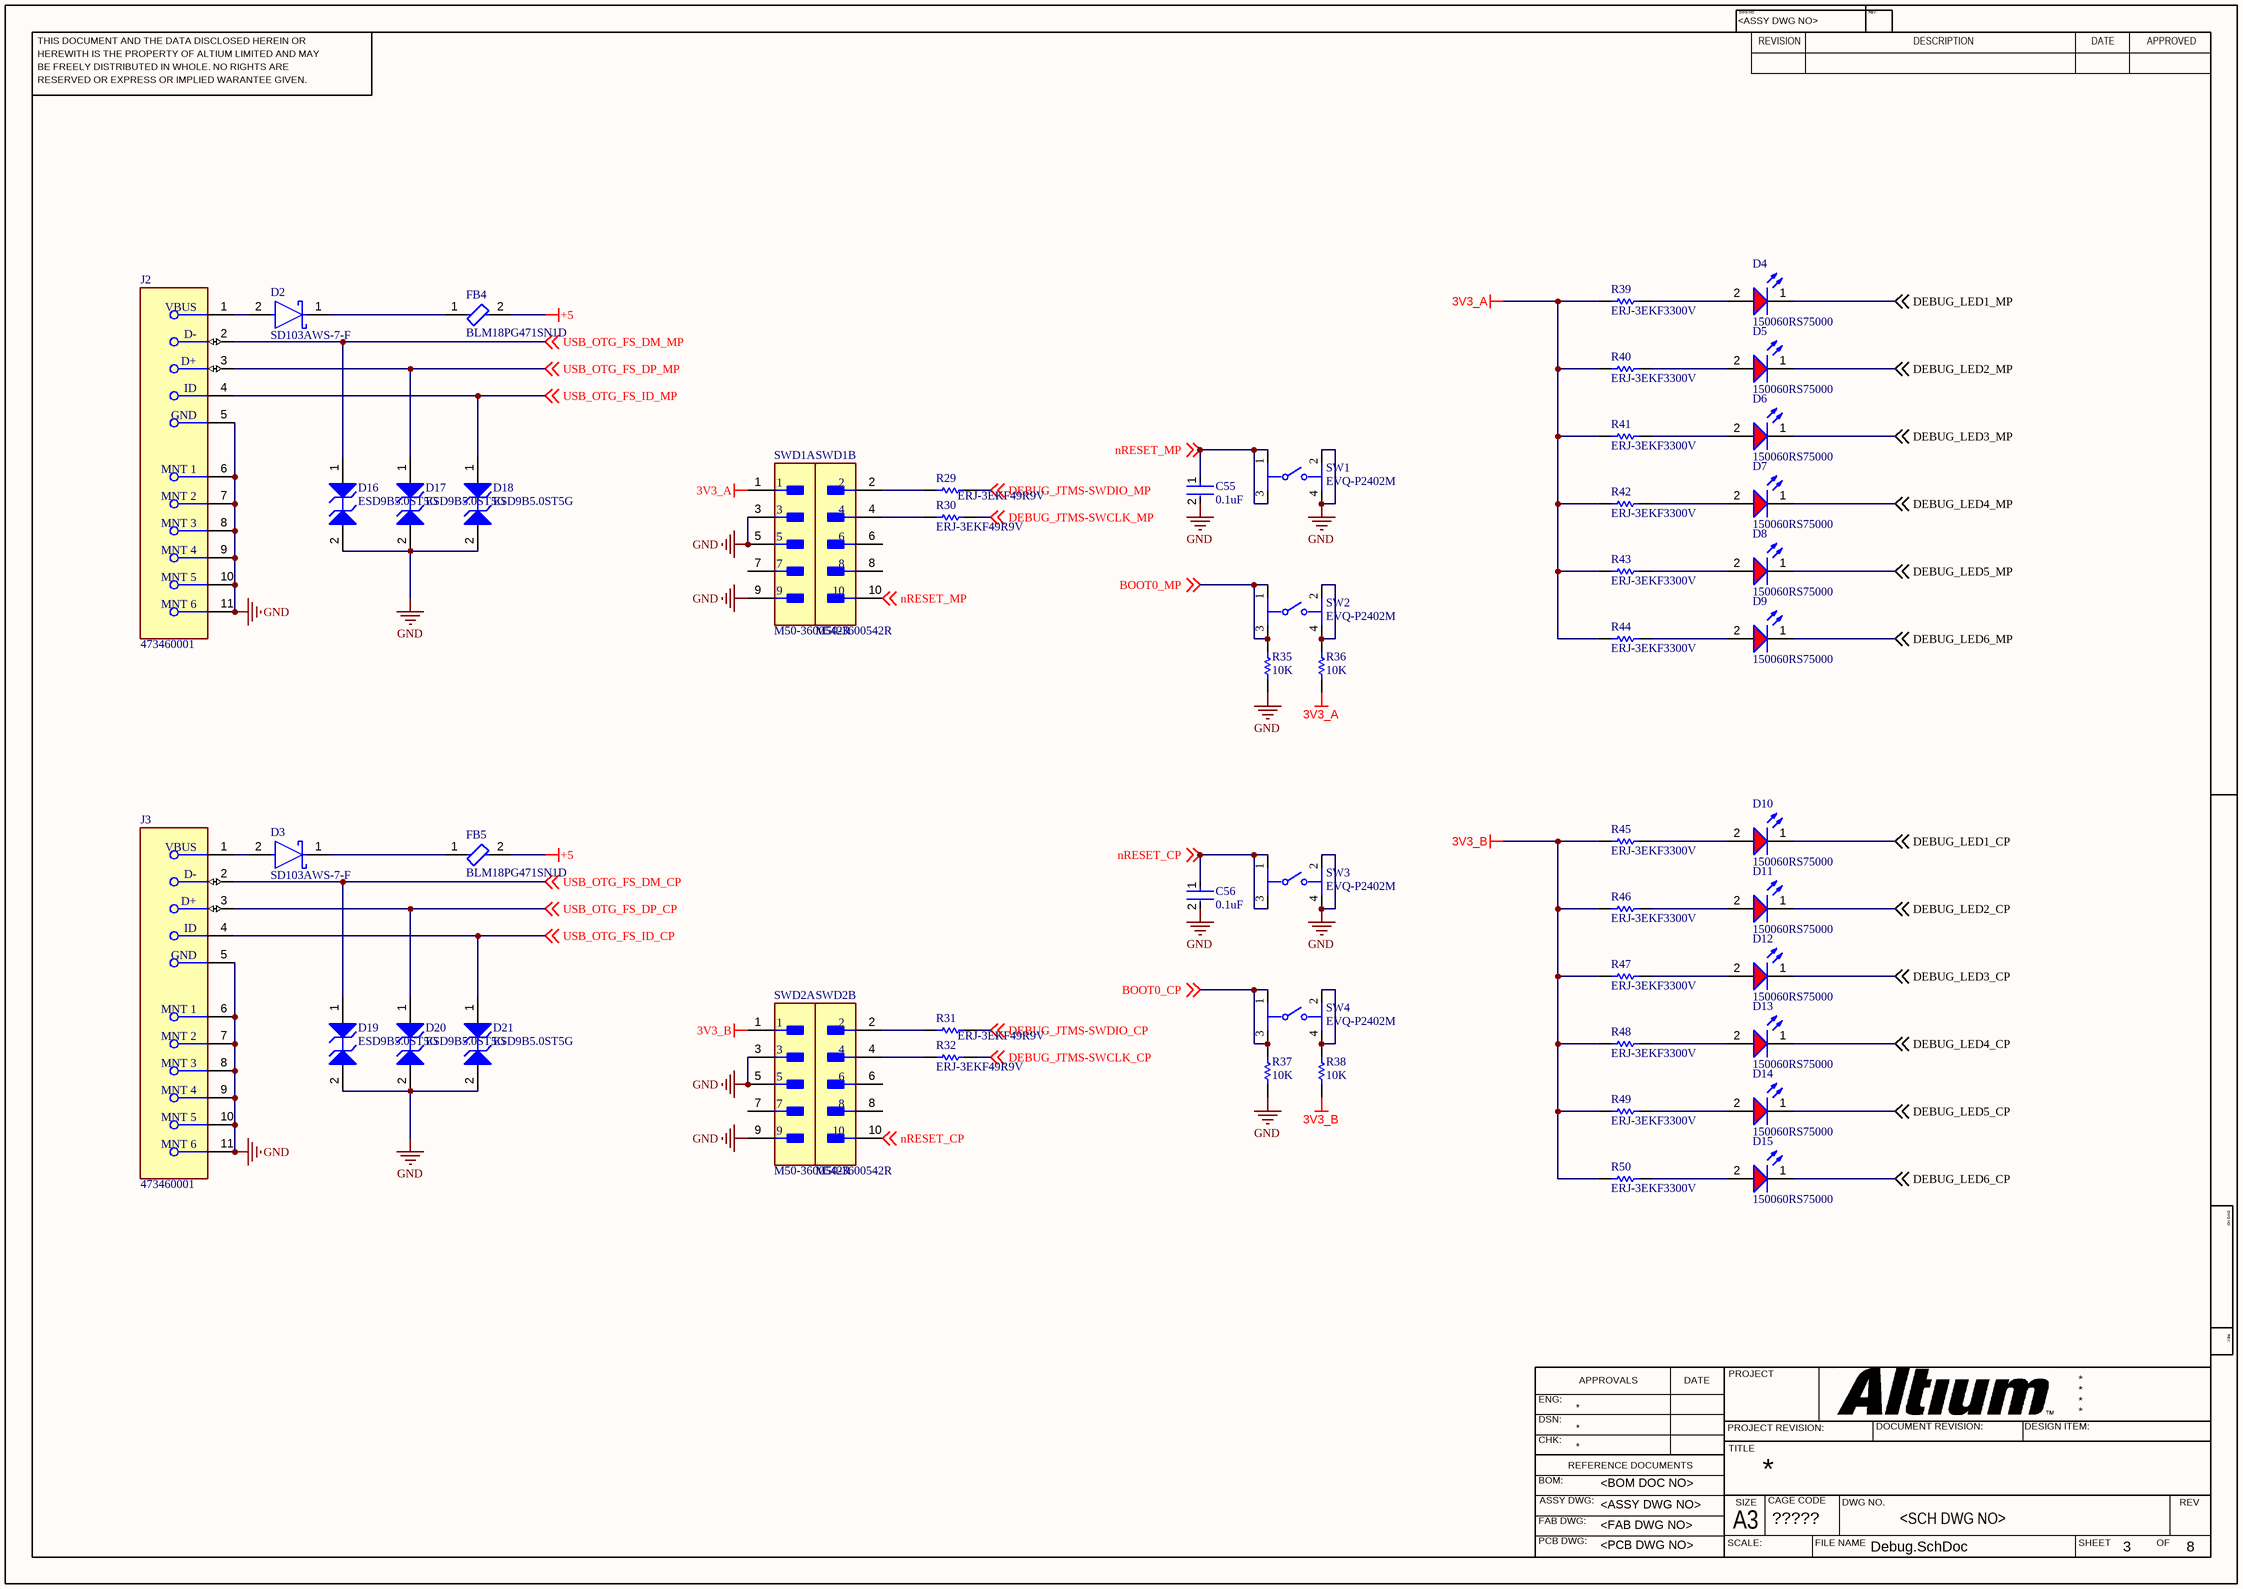
[diagram p2: Debug.SchDoc]

### Parts
C55  0.1uF  [FP-C0603C-CF-MFG]
C56  0.1uF  [FP-C0603C-CF-MFG]
D2  SD103AWS-7-F  [FP-SOD323-MFG]
D3  SD103AWS-7-F  [FP-SOD323-MFG]
D4  150060RS75000  [WL-SMCW_0603_150060xx75000]
D5  150060RS75000  [WL-SMCW_0603_150060xx75000]
D6  150060RS75000  [WL-SMCW_0603_150060xx75000]
D7  150060RS75000  [WL-SMCW_0603_150060xx75000]
D8  150060RS75000  [WL-SMCW_0603_150060xx75000]
D9  150060RS75000  [WL-SMCW_0603_150060xx75000]
D10  150060RS75000  [WL-SMCW_0603_150060xx75000]
D11  150060RS75000  [WL-SMCW_0603_150060xx75000]
D12  150060RS75000  [WL-SMCW_0603_150060xx75000]
D13  150060RS75000  [WL-SMCW_0603_150060xx75000]
D14  150060RS75000  [WL-SMCW_0603_150060xx75000]
D15  150060RS75000  [WL-SMCW_0603_150060xx75000]
D16  ESD9B5.0ST5G  [ONSC-SOD-923-2-514AB-01_V]
D17  ESD9B5.0ST5G  [ONSC-SOD-923-2-514AB-01_V]
D18  ESD9B5.0ST5G  [ONSC-SOD-923-2-514AB-01_V]
D19  ESD9B5.0ST5G  [ONSC-SOD-923-2-514AB-01_V]
D20  ESD9B5.0ST5G  [ONSC-SOD-923-2-514AB-01_V]
D21  ESD9B5.0ST5G  [ONSC-SOD-923-2-514AB-01_V]
FB4  BLM18PG471SN1D  [FP-BLM18-0_15-t0_8-MFG]
FB5  BLM18PG471SN1D  [FP-BLM18-0_15-t0_8-MFG]
J2  473460001  [FP-473460001-MFG]
J3  473460001  [FP-473460001-MFG]
R29  ERJ-3EKF49R9V  [RESC1608X55X30ML15T15]
R30  ERJ-3EKF49R9V  [RESC1608X55X30ML15T15]
R31  ERJ-3EKF49R9V  [RESC1608X55X30ML15T15]
R32  ERJ-3EKF49R9V  [RESC1608X55X30ML15T15]
R35  10K  [RESC1609X55X30LL15T15]
R36  10K  [RESC1609X55X30LL15T15]
R37  10K  [RESC1609X55X30LL15T15]
R38  10K  [RESC1609X55X30LL15T15]
R39  ERJ-3EKF3300V  [RESC1608X55X30LL15T15]
R40  ERJ-3EKF3300V  [RESC1608X55X30LL15T15]
R41  ERJ-3EKF3300V  [RESC1608X55X30LL15T15]
R42  ERJ-3EKF3300V  [RESC1608X55X30LL15T15]
R43  ERJ-3EKF3300V  [RESC1608X55X30LL15T15]
R44  ERJ-3EKF3300V  [RESC1608X55X30LL15T15]
R45  ERJ-3EKF3300V  [RESC1608X55X30LL15T15]
R46  ERJ-3EKF3300V  [RESC1608X55X30LL15T15]
R47  ERJ-3EKF3300V  [RESC1608X55X30LL15T15]
R48  ERJ-3EKF3300V  [RESC1608X55X30LL15T15]
R49  ERJ-3EKF3300V  [RESC1608X55X30LL15T15]
R50  ERJ-3EKF3300V  [RESC1608X55X30LL15T15]
SW1  EVQ-P2402M  [FP-EVQ-P2402M-MFG]
SW2  EVQ-P2402M  [FP-EVQ-P2402M-MFG]
SW3  EVQ-P2402M  [FP-EVQ-P2402M-MFG]
SW4  EVQ-P2402M  [FP-EVQ-P2402M-MFG]
SWD1  M50-3600542R  [FP-M50-3600542R-MFG]  (parts A,B of 2)
SWD2  M50-3600542R  [FP-M50-3600542R-MFG]  (parts A,B of 2)

### Nets
3V3_A: R36.1 R39.1 R40.1 R41.1 R42.1 R43.1 R44.1 SWD1.1
3V3_B: R38.1 R45.1 R46.1 R47.1 R48.1 R49.1 R50.1 SWD2.1
+5: FB4.2 FB5.2
GND: C55.2 C56.2 D16.2(A2) D17.2(A2) D18.2(A2) D19.2(A2) D20.2(A2) D21.2(A2) J2.5(GND) J2.6(MNT_1) J2.7(MNT_2) J2.8(MNT_3) J2.9(MNT_4) J2.10(MNT_5) J2.11(MNT_6) J3.5(GND) J3.6(MNT_1) J3.7(MNT_2) J3.8(MNT_3) J3.9(MNT_4) J3.10(MNT_5) J3.11(MNT_6) R35.1 R37.1 SW1.2 SW1.4 SW3.2 SW3.4 SWD1.3 SWD1.5 SWD1.9 SWD2.3 SWD2.5 SWD2.9
BOOT0_CP: R37.2 SW4.1 SW4.3 ; off-sheet BOOT0_CP
BOOT0_MP: R35.2 SW2.1 SW2.3 ; off-sheet BOOT0_MP
DEBUG_JTMS-SWCLK_CP: R32.2 ; off-sheet DEBUG_JTMS-SWCLK_CP
DEBUG_JTMS-SWCLK_MP: R30.2 ; off-sheet DEBUG_JTMS-SWCLK_MP
DEBUG_JTMS-SWDIO_CP: R31.2 ; off-sheet DEBUG_JTMS-SWDIO_CP
DEBUG_JTMS-SWDIO_MP: R29.2 ; off-sheet DEBUG_JTMS-SWDIO_MP
DEBUG_LED1_CP: D10.1(K) ; off-sheet DEBUG_LED1_CP
DEBUG_LED1_MP: D4.1(K) ; off-sheet DEBUG_LED1_MP
DEBUG_LED2_CP: D11.1(K) ; off-sheet DEBUG_LED2_CP
DEBUG_LED2_MP: D5.1(K) ; off-sheet DEBUG_LED2_MP
DEBUG_LED3_CP: D12.1(K) ; off-sheet DEBUG_LED3_CP
DEBUG_LED3_MP: D6.1(K) ; off-sheet DEBUG_LED3_MP
DEBUG_LED4_CP: D13.1(K) ; off-sheet DEBUG_LED4_CP
DEBUG_LED4_MP: D7.1(K) ; off-sheet DEBUG_LED4_MP
DEBUG_LED5_CP: D14.1(K) ; off-sheet DEBUG_LED5_CP
DEBUG_LED5_MP: D8.1(K) ; off-sheet DEBUG_LED5_MP
DEBUG_LED6_CP: D15.1(K) ; off-sheet DEBUG_LED6_CP
DEBUG_LED6_MP: D9.1(K) ; off-sheet DEBUG_LED6_MP
nRESET_CP: C56.1 SW3.1 SW3.3 SWD2.10 ; off-sheet nRESET_CP
nRESET_MP: C55.1 SW1.1 SW1.3 SWD1.10 ; off-sheet nRESET_MP
USB_OTG_FS_DM_CP: D19.1(A1) J3.2(D-) ; off-sheet USB_OTG_FS_DM_CP
USB_OTG_FS_DM_MP: D16.1(A1) J2.2(D-) ; off-sheet USB_OTG_FS_DM_MP
USB_OTG_FS_DP_CP: D20.1(A1) J3.3(D+) ; off-sheet USB_OTG_FS_DP_CP
USB_OTG_FS_DP_MP: D17.1(A1) J2.3(D+) ; off-sheet USB_OTG_FS_DP_MP
USB_OTG_FS_ID_CP: D21.1(A1) J3.4(ID) ; off-sheet USB_OTG_FS_ID_CP
USB_OTG_FS_ID_MP: D18.1(A1) J2.4(ID) ; off-sheet USB_OTG_FS_ID_MP
NetD2_1: D2.1(C) FB4.1
NetD2_2: D2.2(A) J2.1(VBUS)
NetD3_1: D3.1(C) FB5.1
NetD3_2: D3.2(A) J3.1(VBUS)
NetD4_2: D4.2(A) R39.2
NetD5_2: D5.2(A) R40.2
NetD6_2: D6.2(A) R41.2
NetD7_2: D7.2(A) R42.2
NetD8_2: D8.2(A) R43.2
NetD9_2: D9.2(A) R44.2
NetD10_2: D10.2(A) R45.2
NetD11_2: D11.2(A) R46.2
NetD12_2: D12.2(A) R47.2
NetD13_2: D13.2(A) R48.2
NetD14_2: D14.2(A) R49.2
NetD15_2: D15.2(A) R50.2
NetR29_1: R29.1 SWD1.2
NetR30_1: R30.1 SWD1.4
NetR31_1: R31.1 SWD2.2
NetR32_1: R32.1 SWD2.4
NetR36_2: R36.2 SW2.2 SW2.4
NetR38_2: R38.2 SW4.2 SW4.4

Not connected (* = marked no-connect by the designer): SWD1 6 7 8; SWD2 6 7 8

### Notes on the sheet
- THIS DOCUMENT AND THE DATA DISCLOSED HEREIN OR
- HEREWITH IS THE PROPERTY OF ALTIUM LIMITED AND MAY
- DWG NO:
- REVISION
- REV:
- DESCRIPTION
- DATE
- APPROVED
- BE FREELY DISTRIBUTED IN WHOLE. NO RIGHTS ARE
- RESERVED OR EXPRESS OR IMPLIED WARANTEE GIVEN.
- ENG:
- APPROVALS
- PROJECT
- DSN:
- CHK:
- REFERENCE DOCUMENTS
- PROJECT REVISION:
- TITLE
- DOCUMENT REVISION:
- DESIGN ITEM:
- BOM:
- FAB DWG:
- PCB DWG:
- ASSY DWG:
- SCALE:
- A3
- SIZE
- CAGE CODE
- FILE NAME
- DWG NO.
- SHEET
- OF
- REV

### Library data of the parts
C55 C56 = CMP-2006-03061-2: as C2 on sheet MainProcessor; Temperature: -55°C to +125°C; RoHS: TRUE; Temperature Range High: +125°C; Lead Free: Yes; Octopart: https://octopart.com/c0603c104k5ractu-kemet-139244; Digikey Description: CAP CER 0.1UF 50V X7R 0603; Category: Cap; Package: C0603C-CF; ComponentLink2Description: Datasheet; Temperature Range Low: -55°C; Device Class L1: Passive Components; Voltage Rating: 50 V; Automotive: Yes; Device Class L3: Ceramic Capacitors; ComponentLink2URL: https://api.kemet.com/component-edge/download/datasheet/C0603C100J5GACAUTO.pdf; Capacitance: 0.10 μF; Device Class L2: Capacitors; Temperature Characteristic: X7R; Height: 0.87mm
D2 D3 = CMP-12790-000048-1: DIODE SCHOTTKY 40V 350MA SOD323; Manufacturer: Diodes Inc.; Max Surge Forward Current: 1.5A; Capacitance: 35pF; Peak Reverse Current: 5uA; Standoff Height: 0.05mm; Max Junction Temp: +125°C; Value: 35pF; Automotive Grade: Grade 1; ComponentLink2URL: https://www.diodes.com/assets/Datasheets/ds30101.pdf; Ipc Land Pattern Name: SOD250130X110-2; Octopart: https://octopart.com/sd103aws-7-f-diodes+inc.-55389602; Forward Current: 350mA; Device Class L1: Discrete Semiconductors; Lead Free: Yes; ComponentLink2Description: Datasheet; RoHS: TRUE; Temperature: -65°C to +125°C; Temperature Range Low: -65°C; Category: Diode; Package: SOD323; Digikey Description: DIODE SCHOTTKY 40V 350MA SOD323; Automotive: Yes; Device Class L2: Diodes; Mouser Description: Schottky Diodes & Rectifiers 40V 200mW; Manufacturer Part Number: SD103AWS-7-F; Device Class L3: Schottky Diodes; Max Repetitive Reverse Voltage: 40V; Footprint Url: https://www.diodes.com/assets/Package-Files/SOD323.pdf; Reverse Voltage: 40V; Temperature Range High: +125°C; Height: 1.2mm
D4-D15 = CMP-1426-00001-4: LED Low-Power Uni-Color Red 630nm 2V 2-Pin Chip 0603(1608Metric) T/R; Max Junction Temperature (Tj): 95°C; Dominant Wavelength: 625nm; Lens Style: Clear, Rectangular; Viewing Angle: 140°; Forward Current: 100mA; Max Reverse Voltage (DC): 5V; Luminous Intensity: 250mcd; Test Current: 20mA; Power Dissipation: 72mW; Max Operating Temperature: 85°C; Mount: Surface Mount; Height: 700µm; Packaging: Tape and Reel; REACH SVHC: Unknown; Case Code (Metric): 1608; Peak Wavelength: 630nm; Forward Voltage: 2V; Case/Package: 0603; Color: Red; RoHS: Compliant; Width: 800µm; Reverse Voltage: 5V; Min Operating Temperature: -40°C; Wavelength: 625nm; Case Code (Imperial): 0603; Length: 1.6mm
D16-D21 = CMP-1063-00119-1: Transient Voltage Suppressor, Micro-Packaged Diode for ESD Protection, 2-Pin SOD-923, Pb-Free, Tape and Reel; Manufacturer: On Semiconductor; Number of Lines: 1; Direction: Bidirectional; V(BR) Min (V): 5.8; VRWM Max (V): 5; Packing: Tape and Reel; PackageDescription: 2-Pin SOD, Body 0.8 x 0.6 mm; IR Max (uA): 1; ComponentLink3Description: Package Specification; PartNumber: ESD9B5.0ST5G; ComponentLink1URL: http://www.onsemi.com/; RoHS: Pb-Free; Mounting Technology: Surface Mount; DatasheetVersion: Rev. 2; ComponentLink2URL: http://www.onsemi.cn/pub_link/Collateral/ESD9B-D.PDF; ComponentLink3URL: http://www.onsemi.com/pub_link/Collateral/514AB.PDF; PackageReference: SOD-923-2-514AB-01; PackageVersion: Rev. C, 03/2011; ComponentLink1Description: Manufacturer URL; ComponentLink2Description: Datasheet
FB4 FB5 = CMP-0686-00587-3: as FB1 on sheet MainProcessor; Core Material: Ferrite; Width: 0.8mm; Termination: SMD/SMT; Series: BLM18P; Min Operating Temperature: -55°C; DC Resistance-Max: 200mR; Current Rating: 1A; Package Quantity: 1; Max Operating Temperature: 125°C; Military Standard: Not; REACH SVHC: No SVHC; Max Current Rating: 1A; Number of Pins: 2; RoHS Compliant: Yes; Tolerance: 25%; Packaging: Tape and Reel; Number of Lines: 1; Resistance: 200mR; Length: 1.6mm; Case Code (Metric): 1608; Depth: 0.8mm; Lead Free: Lead Free; Case/Package: 0603; Height: 0.8mm; Radiation Hardening: No; Test Frequency: 100MHz; Case Code (Imperial): 0603; Max DC Current: 1A; DC Current: 1A
J2 J3 = CMP-2000-05246-2: CONN RCPT USB2.0 MICRO B SMD R/A; Manufacturer: Molex; Conn Orientation: Right Angle; Is Female: yes; Shielding: true; Pitch: 0.65mm; Number Of Contacts: 5; Voltage Rating: 30V; Current Rating: 1.8A; Device Class L2: USB Connectors; Digikey Description: CONN RCPT USB2.0 MICRO B SMD R/A; Height: 2.945mm; RoHS: TRUE; ComponentLink2Description: Datasheet; Octopart: https://octopart.com/47346-0001-molex-7164928; Automotive: No; Package: 0; Category: Conn; Device Class L1: Connectors; Usb Standard: USB 2.0; Temperature: -30°C to +85°C; Temperature Range Low: -30°C; Footprint Url: https://www.molex.com/pdm_docs/sd/473460001_sd.pdf; ComponentLink2URL: https://www.molex.com/webdocs/datasheets/pdf/en-us/0473460001_IO_CONNECTORS.pdf; Lead Free: Yes; Manufacturer Part Number: 473460001; Contact Material: Gold,Nickel; Temperature Range High: +85°C; Device Class L3: unset
R29-R32 = CMP-2000-00538-1: Manufacturer: Panasonic; Part Number: ERJ-3EKF49R9V
R35-R38 = CMP-1012-00623-3: Chip Resistor, 10 KOhm, +/- 1%, 0.1 W, -55 to 155 degC, 0603 (1608 Metric), RoHS, Tape and Reel; Manufacturer: Panasonic; Voltage Rating: 75V; Case\/Package: 0603; Power Rating: 100mW; Resistance: 10KOhm; Temperature Coefficient: 100ppm\/degreesC; Number of Pins: 2; Package Reference: 603; Depth: 0.8mm; Mount: SurfaceMount; Package Description: 2-Pin Surface Mount Device, Body 1.6 x 0.85 mm; Datasheet Version: 02/2017; Length: 1.6mm; Lead Free: LeadFree; Height: 0.45mm; Number of Terminations: 2; Max Power Dissipation: 100mW; Min Operating Temperature: -55degC; Datasheet URL: https://industrial.panasonic.com/cdbs/www-data/pdf/RDA0000/AOA0000C304.pdf; Termination: SMD/SMT; Case Code (Metric): 1608; Case Code (Imperial): 0603; Tolerance: 1%; Max Operating Temperature: 155degC; RoHSCompliant: true; Voltage Rating (DC): 75V; Radiation Hardening: No; Packaging: TapeandReel; Composition: ThickFilm; Mounting Technology: SurfaceMount; Manufacturer URL: http://www.panasonic.com/; Width: 0.031inch; REACH SVHC: NoSVHC; Contact Plating: Tin; Military Standard: Not; Package Quantity: 1
R39-R50 = CMP-2000-00435-2: Chip Resistor, 330 Ohm, +/- 1%, 0.1 W, -55 to 155 degC, 0603 (1608 Metric), RoHS, Tape and Reel; Gender: Male; Mating Cycles: 10000; Current Rating: 500 mA; Voltage Rating: 10 V; REACH SVHC: No SVHC; PackageDescription: 2-Pin Surface Mount Device, Body 1.6 x 0.85 mm; Contact Finish: Gold; Pins: 8; ComponentLink1Description: Manufacturer URL; Packaging: Tape and Reel; Max Operating Temperature: 85 degC; Contact Material: Copper; Height: 1.45 mm; Width: 1.45 mm; DatasheetVersion: Apr-15; Package Quantity: 1500; Contact Plating: Gold; PackageReference: 0603; Mount: Surface Mount; Lead Pitch: 1.1 mm; Min Operating Temperature: -25 degC; ComponentLink1URL: http://www.panasonic.com/; ComponentLink2URL: http://industrial.panasonic.com/cdbs/www-data/pdf/RDA0000/AOA0000C86.pdf; Length: 13.7 mm; ComponentLink2Description: Datasheet; RoHSCompliant: true
SW1-SW4 = CMP-05618-000087-1: SWITCH TACTILE SPST-NO 0.02A 15V; Mechanical Life: 500000Cycles; Contact Resistance: 100mR; Max Current Rating: 20mA; Throw Configuration: SPST; Switch Function: Off-Mom; Illumination Type: Non-Illuminated; Actuator Color: Natural; Operating Force: 2.4N; Actuator Length: 0.45mm; Switch Travel: 0.25mm; Color: Clear; Size: 3.5mm; Radiation Hardening: No; Mount: Surface Mount; Package Quantity: 1; Length: 3.5mm; Height: 2.1mm; Series: EVQP2; Contact Current Rating: 20mA; Termination: J-Bend; Electrical Life: 500000Cycles; Packaging: Tape and Reel; Current Rating: 20mA; Max Operating Temperature: 85°C; Orientation: Straight; Width: 3.5mm; Max Voltage Rating (DC): 15V; RoHS Compliant: Yes; REACH SVHC: No SVHC; Min Operating Temperature: -40°C; Depth: 5.5mm; Voltage Rating (DC): 15V; Lead Free: Lead Free
SWD1 SWD2 = CMP-15831-000038-1: CONN HEADER SMD 10POS 1.27MM; Number of Contacts: 10; Max Current Rating: 1A; Gender: Male; Contact Resistance: 30mR; Radiation Hardening: No; RoHS Compliant: Yes; Length: 6.35mm; Max Operating Temperature: 105°C; Termination: Solder; Contact Plating: Gold; Number of Rows: 2; Pitch: 1.27mm; Housing Material: Thermoplastic; Depth: 3.41mm; Orientation: Straight; Contact Material: Copper Alloy; Min Operating Temperature: -40°C

## Sheet Baro_Mag.SchDoc
size 420 x 297 mm; SheetNumber: 5; SheetTotal: 7
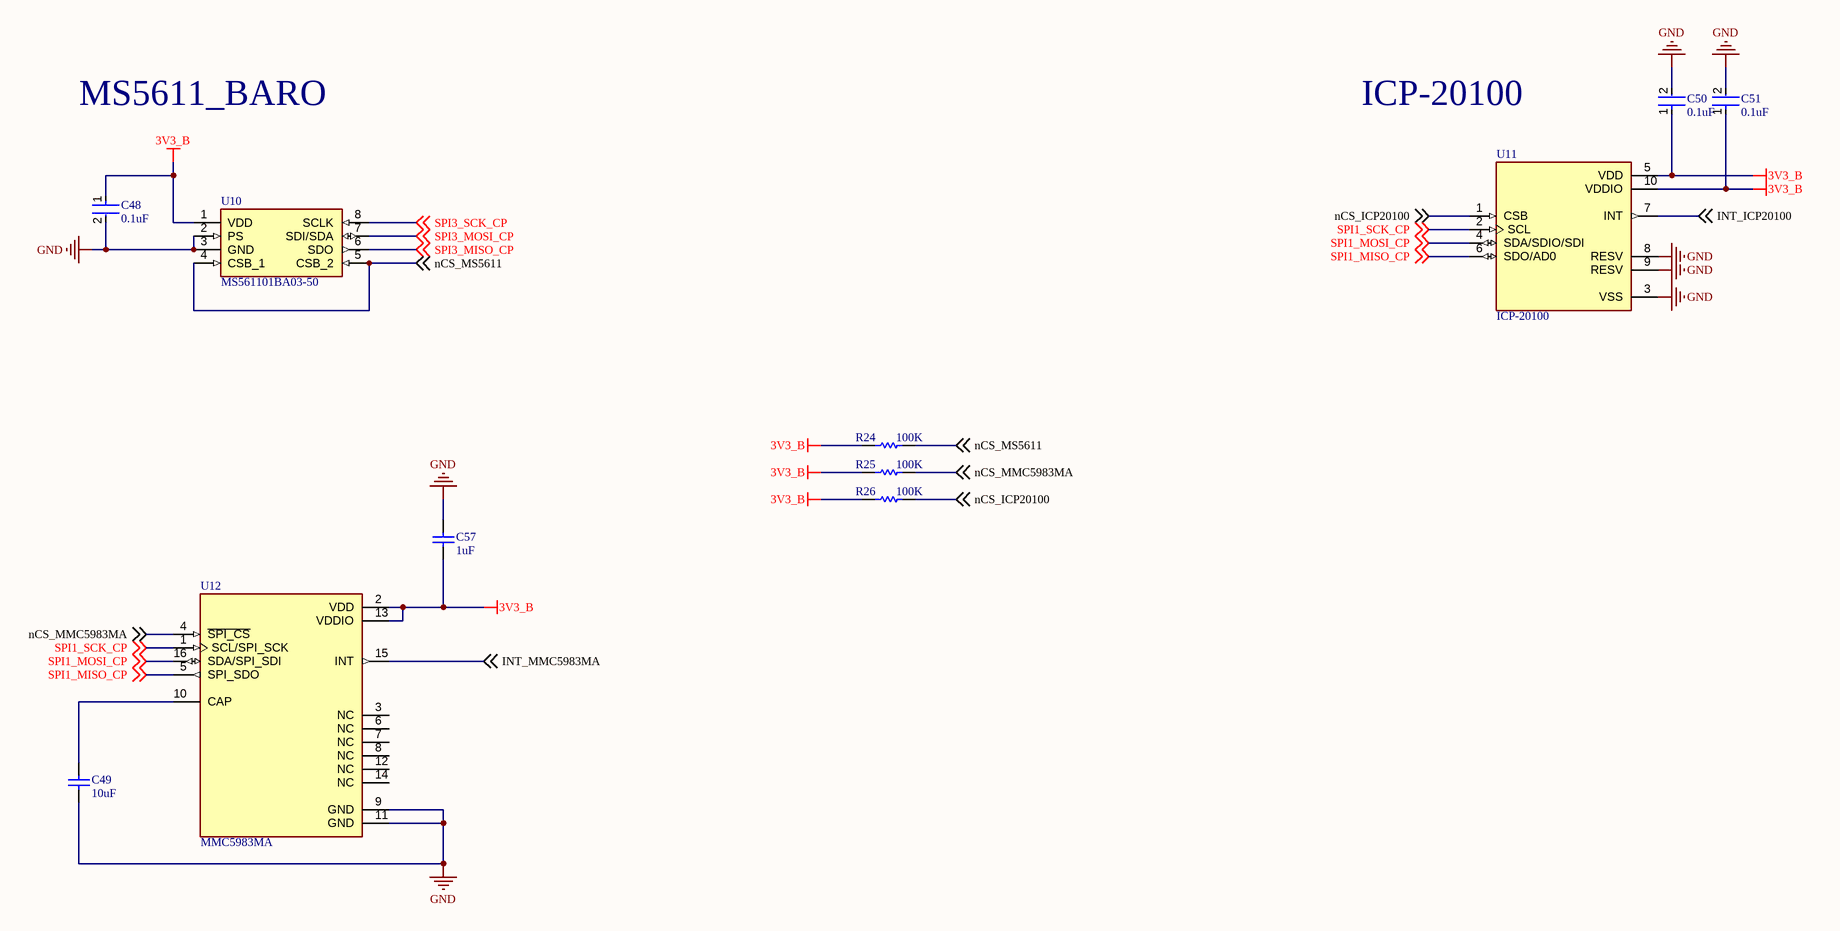
[diagram p3: Baro_Mag.SchDoc]

### Parts
C48  0.1uF  [FP-C0603C-CF-MFG]
C49  10uF  [CAPC2013X145X50LL20T25]
C50  0.1uF  [FP-C0603C-CF-MFG]
C51  0.1uF  [FP-C0603C-CF-MFG]
C57  1uF  [CAPC1608X90X35LL15T15]
R24  100K  [RESC1608X55X30ML20T10]
R25  100K  [RESC1608X55X30ML20T10]
R26  100K  [RESC1608X55X30ML20T10]
U10  MS561101BA03-50  [MS561101BA03-50]
U11  ICP-20100  [PQFN50P200X200X85-10N]
U12  MMC5983MA  [PQFN50P300X300X100-16N]

### Nets
3V3_B: C48.1 C50.1 C51.1 C57.1 R24.2 R25.2 R26.2 U10.1(VDD) U11.5(VDD) U11.10(VDDIO) U12.2(VDD) U12.13(VDDIO)
GND: C48.2 C49.2 C50.2 C51.2 C57.2 U10.2(PS) U10.3(GND) U11.3(VSS) U11.8(RESV) U11.9(RESV) U12.9(GND) U12.11(GND)
INT_ICP20100: U11.7(INT) ; off-sheet INT_ICP20100
INT_MMC5983MA: U12.15(INT) ; off-sheet INT_MMC5983MA
nCS_ICP20100: R26.1 U11.1(CSB) ; off-sheet nCS_ICP20100
nCS_MMC5983MA: R25.1 U12.4(~{SPI_CS}) ; off-sheet nCS_MMC5983MA
nCS_MS5611: R24.1 U10.4(CSB_1) U10.5(CSB_2) ; off-sheet nCS_MS5611
SPI1_MISO_CP: U11.6(SDO/AD0) U12.5(SPI_SDO) ; off-sheet SPI1_MISO_CP
SPI1_MOSI_CP: U11.4(SDA/SDIO/SDI) U12.16(SDA/SPI_SDI) ; off-sheet SPI1_MOSI_CP
SPI1_SCK_CP: U11.2(SCL) U12.1(SCL/SPI_SCK) ; off-sheet SPI1_SCK_CP
SPI3_MISO_CP: U10.6(SDO) ; off-sheet SPI3_MISO_CP
SPI3_MOSI_CP: U10.7(SDI/SDA) ; off-sheet SPI3_MOSI_CP
SPI3_SCK_CP: U10.8(SCLK) ; off-sheet SPI3_SCK_CP
NetC49_1: C49.1 U12.10(CAP)

Not connected (* = marked no-connect by the designer): U12 3(NC) 6(NC) 7(NC) 8(NC) 12(NC) 14(NC)

### Notes on the sheet
- MS5611_BARO
- ICP-20100
- THIS DOCUMENT AND THE DATA DISCLOSED HEREIN OR
- HEREWITH IS THE PROPERTY OF ALTIUM LIMITED AND MAY
- DWG NO:
- REVISION
- REV:
- DESCRIPTION
- DATE
- APPROVED
- BE FREELY DISTRIBUTED IN WHOLE. NO RIGHTS ARE
- RESERVED OR EXPRESS OR IMPLIED WARANTEE GIVEN.
- ENG:
- APPROVALS
- PROJECT
- DSN:
- CHK:
- REFERENCE DOCUMENTS
- PROJECT REVISION:
- TITLE
- DOCUMENT REVISION:
- DESIGN ITEM:
- BOM:
- FAB DWG:
- PCB DWG:
- ASSY DWG:
- SCALE:
- A3
- SIZE
- CAGE CODE
- FILE NAME
- DWG NO.
- SHEET
- OF
- REV

### Library data of the parts
C48 C50 C51 = CMP-2006-03061-2: as C2 on sheet MainProcessor; Temperature: -55°C to +125°C; RoHS: TRUE; Temperature Range High: +125°C; Lead Free: Yes; Octopart: https://octopart.com/c0603c104k5ractu-kemet-139244; Digikey Description: CAP CER 0.1UF 50V X7R 0603; Category: Cap; Package: C0603C-CF; ComponentLink2Description: Datasheet; Temperature Range Low: -55°C; Device Class L1: Passive Components; Voltage Rating: 50 V; Automotive: Yes; Device Class L3: Ceramic Capacitors; ComponentLink2URL: https://api.kemet.com/component-edge/download/datasheet/C0603C100J5GACAUTO.pdf; Capacitance: 0.10 μF; Device Class L2: Capacitors; Temperature Characteristic: X7R; Height: 0.87mm
C49 = CMP-2007-01044-1: as C1 on sheet MainProcessor
C57 = CMP-2006-02298-2: as C13 on sheet MainProcessor
R24-R26 = CMP-2000-01852-1: as R5 on sheet MainProcessor
U10 = MS561101BA03-50: Integrated Circuit; Manufacturer_Name: TE Connectivity; Datasheet Link: https://www.te.com/commerce/DocumentDelivery/DDEController?Action=srchrtrv&DocNm=MS5611-01BA03&DocType=Data%20Sheet&DocLang=English&PartCntxt=MS561101BA03-50&DocFormat=pdf; Manufacturer_Part_Number: MS561101BA03-50; Mouser Part Number: 824-MS561101BA03-50; Mouser Price/Stock: https://www.mouser.co.uk/ProductDetail/Measurement-Specialties/MS561101BA03-50?qs=%252BgKeJhng5iV%252BnCz6Qd5iDw%3D%3D; Arrow Part Number: MS561101BA03-50; Arrow Price/Stock: https://www.arrow.com/en/products/ms561101ba03-50/te-connectivity?utm_currency=USD&region=nac
U11 = CMP-010-00027-1: MF: TDK InvenSense; Availability: Not in stock; SnapEDA_Link: https://www.snapeda.com/parts/ICP-20100/TDK%20InvenSense/view-part/7331147/?ref=snap; Check_prices: https://www.snapeda.com/parts/ICP-20100/TDK%20InvenSense/view-part/7331147/?ref=eda; Source: ICP-20100.SchLib; Pins: 10; Value: *; Component Type: Standard; Case/Package: None; Design Item ID: ICP-20100; Price: None; MP: ICP-20100
U12 = CMP-051-000000-1: MMC5983 series Magnetic, Magnetometer Sensor Evaluation Board; MF: Memsic Inc.; Component Type: Standard; Price: None; Source: MMC5983MA.SchLib; Value: *; MP: MMC5983MA; Design Item ID: MMC5983MA; Package: VFLGA-16 Memsic Inc.; Pin Count: 16; Availability: In Stock; Purchase-URL: https://pricing.snapeda.com/search/part/MMC5983MA/?ref=eda; SnapEDA_Link: https://www.snapeda.com/parts/MMC5983MA/Memsic+Inc./view-part/?ref=snap; Check_prices: https://www.snapeda.com/parts/MMC5983MA/Memsic+Inc./view-part/?ref=eda

## Nets that join several sheets
3V3_A: MainProcessor (27 pins), Debug (8 pins)
3V3_B: CoProcessor (23 pins), Debug (8 pins), Baro_Mag (12 pins)
GND: MainProcessor (30 pins), CoProcessor (29 pins), Debug (34 pins), Baro_Mag (12 pins)
BOOT0_CP: CoProcessor (U6.94), Debug (R37.2 SW4.1 SW4.3)
BOOT0_MP: MainProcessor (U3.94), Debug (R35.2 SW2.1 SW2.3)
DEBUG_JTMS-SWCLK_CP: CoProcessor (U6.76), Debug (R32.2)
DEBUG_JTMS-SWCLK_MP: MainProcessor (U3.76), Debug (R30.2)
DEBUG_JTMS-SWDIO_CP: CoProcessor (U6.72), Debug (R31.2)
DEBUG_JTMS-SWDIO_MP: MainProcessor (U3.72), Debug (R29.2)
DEBUG_LED1_CP: CoProcessor (U6.81), Debug (D10.1)
DEBUG_LED1_MP: MainProcessor (U3.97), Debug (D4.1)
DEBUG_LED2_CP: CoProcessor (U6.82), Debug (D11.1)
DEBUG_LED2_MP: MainProcessor (U3.98), Debug (D5.1)
DEBUG_LED3_CP: CoProcessor (U6.83), Debug (D12.1)
DEBUG_LED3_MP: MainProcessor (U3.15), Debug (D6.1)
DEBUG_LED4_CP: CoProcessor (U6.84), Debug (D13.1)
DEBUG_LED4_MP: MainProcessor (U3.16), Debug (D7.1)
DEBUG_LED5_CP: CoProcessor (U6.85), Debug (D14.1)
DEBUG_LED5_MP: MainProcessor (U3.17), Debug (D8.1)
DEBUG_LED6_CP: CoProcessor (U6.86), Debug (D15.1)
DEBUG_LED6_MP: MainProcessor (U3.18), Debug (D9.1)
INT_ICP20100: CoProcessor (U6.97), Baro_Mag (U11.7)
INT_MMC5983MA: CoProcessor (U6.95), Baro_Mag (U12.15)
nCS_ICP20100: CoProcessor (U6.98), Baro_Mag (R26.1 U11.1)
nCS_MMC5983MA: CoProcessor (U6.96), Baro_Mag (R25.1 U12.4)
nCS_MS5611: CoProcessor (U6.77), Baro_Mag (R24.1 U10.4 U10.5)
nRESET_CP: CoProcessor (U6.14), Debug (C56.1 SW3.1 SW3.3 SWD2.10)
nRESET_MP: MainProcessor (U3.14), Debug (C55.1 SW1.1 SW1.3 SWD1.10)
SPI1_MISO_CP: CoProcessor (U6.90), Baro_Mag (U11.6 U12.5)
SPI1_MOSI_CP: CoProcessor (U6.91), Baro_Mag (U11.4 U12.16)
SPI1_SCK_CP: CoProcessor (U6.89), Baro_Mag (U11.2 U12.1)
SPI3_MISO_CP: CoProcessor (U6.79), Baro_Mag (U10.6)
SPI3_MOSI_CP: CoProcessor (U6.80), Baro_Mag (U10.7)
SPI3_SCK_CP: CoProcessor (U6.78), Baro_Mag (U10.8)
USB_OTG_FS_DM_CP: CoProcessor (U6.70), Debug (D19.1 J3.2)
USB_OTG_FS_DM_MP: MainProcessor (U3.70), Debug (D16.1 J2.2)
USB_OTG_FS_DP_CP: CoProcessor (U6.71), Debug (D20.1 J3.3)
USB_OTG_FS_DP_MP: MainProcessor (U3.71), Debug (D17.1 J2.3)
USB_OTG_FS_ID_CP: CoProcessor (U6.69), Debug (D21.1 J3.4)
USB_OTG_FS_ID_MP: MainProcessor (U3.69), Debug (D18.1 J2.4)